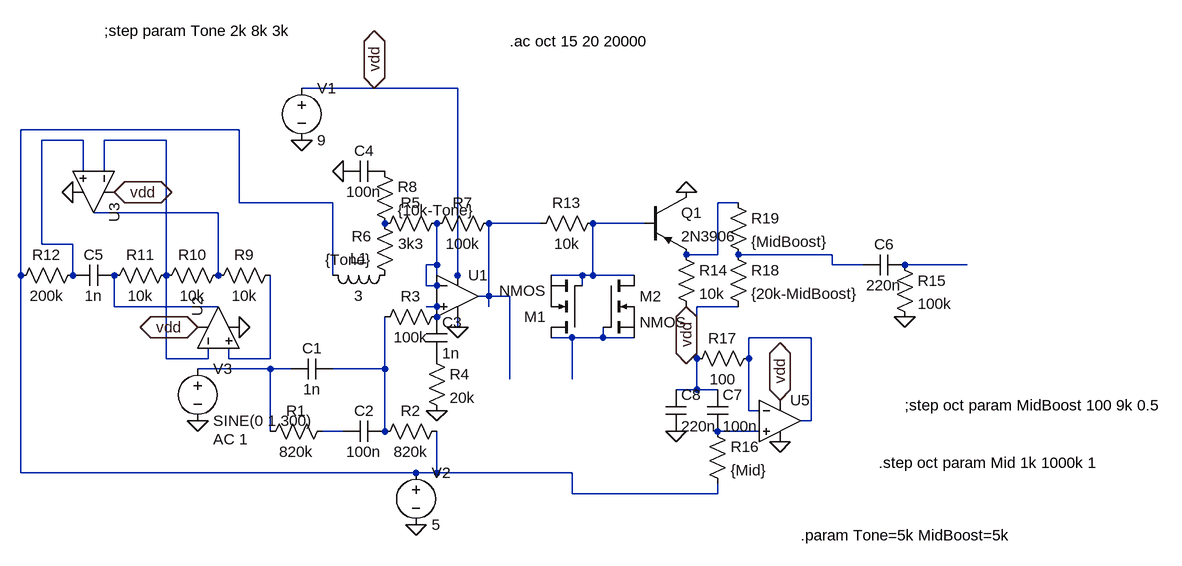
[diagram p0: schematic blue distortion.asc]
blue distortion.asc, the LTspice schematic file:
Version 4
SHEET 1 1308 680
WIRE 64 -96 -48 -96
WIRE 192 -96 64 -96
WIRE -144 -32 -480 -32
WIRE -384 -16 -448 -16
WIRE -256 -16 -352 -16
WIRE -384 32 -384 -16
WIRE -352 32 -352 -16
WIRE -144 80 -144 -32
WIRE 0 80 -144 80
WIRE 624 80 592 80
WIRE -176 96 -368 96
WIRE 320 112 240 112
WIRE 480 112 400 112
WIRE -448 144 -448 -16
WIRE -400 144 -448 144
WIRE 592 160 592 80
WIRE 592 160 544 160
WIRE 768 160 624 160
WIRE 160 176 160 112
WIRE 160 176 144 176
WIRE 768 176 768 160
WIRE 816 176 768 176
WIRE 976 176 880 176
WIRE -480 192 -480 -32
WIRE -400 192 -400 144
WIRE -256 192 -256 -16
WIRE -176 192 -176 96
WIRE 0 192 0 80
WIRE 192 192 192 -96
WIRE 384 192 336 192
WIRE 400 192 400 112
WIRE 400 192 384 192
WIRE 464 192 400 192
WIRE 144 208 144 176
WIRE 160 208 160 176
WIRE 160 208 144 208
WIRE 192 208 192 192
WIRE 384 208 384 192
WIRE 240 224 240 112
WIRE 240 224 224 224
WIRE 272 224 240 224
WIRE -336 240 -336 192
WIRE -176 240 -336 240
WIRE 160 240 144 240
WIRE 240 240 240 224
WIRE 624 240 560 240
WIRE 160 256 160 240
WIRE 192 272 192 256
WIRE 368 288 336 288
WIRE 416 288 416 272
WIRE 416 288 368 288
WIRE 464 288 416 288
WIRE 736 288 640 288
WIRE -256 320 -256 192
WIRE -192 320 -192 304
WIRE -192 320 -256 320
WIRE -160 320 -160 304
WIRE -96 320 -96 192
WIRE -96 320 -160 320
WIRE 560 320 560 240
WIRE 640 320 640 288
WIRE -96 336 -208 336
WIRE -64 336 -96 336
WIRE 80 336 80 256
WIRE 80 336 0 336
WIRE 272 352 272 224
WIRE 368 352 368 288
WIRE 560 368 560 320
WIRE 560 368 528 368
WIRE 592 368 560 368
WIRE 640 400 640 320
WIRE 656 400 640 400
WIRE 736 416 736 288
WIRE 736 416 720 416
WIRE -96 432 -96 336
WIRE 16 432 -16 432
WIRE 80 432 80 336
WIRE 656 432 592 432
WIRE -480 496 -480 192
WIRE 128 496 -480 496
WIRE 160 496 160 432
WIRE 160 496 128 496
WIRE 368 496 160 496
WIRE 368 528 368 496
WIRE 592 528 592 512
WIRE 592 528 368 528
FLAG -48 -16 0
FLAG 192 272 0
FLAG 128 576 0
FLAG 160 400 0
FLAG -208 416 0
FLAG 16 32 0
FLAG -400 64 0
FLAG 64 -96 vdd
IOPIN 64 -96 BiDir
FLAG -208 272 vdd
IOPIN -208 272 BiDir
FLAG -336 64 vdd
IOPIN -336 64 BiDir
FLAG -144 272 0
FLAG 544 240 vdd
IOPIN 544 240 BiDir
FLAG 544 64 0
FLAG 880 256 0
FLAG 688 448 0
FLAG 688 384 vdd
IOPIN 688 384 BiDir
FLAG 528 432 0
SYMBOL voltage -48 -112 R0
WINDOW 123 0 0 Left 0
WINDOW 39 0 0 Left 0
SYMATTR InstName V1
SYMATTR Value 9
SYMBOL voltage 128 480 R0
WINDOW 123 0 0 Left 0
WINDOW 39 0 0 Left 0
SYMATTR InstName V2
SYMATTR Value 5
SYMBOL cap 0 320 R90
WINDOW 0 0 32 VBottom 2
WINDOW 3 32 32 VTop 2
SYMATTR InstName C1
SYMATTR Value 1n
SYMBOL cap 80 416 R90
WINDOW 0 0 32 VBottom 2
WINDOW 3 32 32 VTop 2
SYMATTR InstName C2
SYMATTR Value 100n
SYMBOL res 176 416 R90
WINDOW 0 0 56 VBottom 2
WINDOW 3 32 56 VTop 2
SYMATTR InstName R2
SYMATTR Value 820k
SYMBOL res 176 240 R90
WINDOW 0 0 56 VBottom 2
WINDOW 3 32 56 VTop 2
SYMATTR InstName R3
SYMATTR Value 100k
SYMBOL cap 144 256 R0
SYMATTR InstName C3
SYMATTR Value 1n
SYMBOL res 144 304 R0
SYMATTR InstName R4
SYMATTR Value 20k
SYMBOL voltage -208 320 R0
WINDOW 123 24 124 Left 2
WINDOW 39 0 0 Left 0
SYMATTR InstName V3
SYMATTR Value SINE(0 1 300)
SYMATTR Value2 AC 1
SYMBOL res 176 96 R90
WINDOW 0 0 56 VBottom 2
WINDOW 3 32 56 VTop 2
SYMATTR InstName R5
SYMATTR Value 3k3
SYMBOL res 96 208 R180
WINDOW 0 36 76 Left 2
WINDOW 3 36 40 Left 2
SYMATTR InstName R6
SYMATTR Value {Tone}
SYMBOL res 256 96 R90
WINDOW 0 0 56 VBottom 2
WINDOW 3 32 56 VTop 2
SYMATTR InstName R7
SYMATTR Value 100k
SYMBOL res 64 16 R0
SYMATTR InstName R8
SYMATTR Value {10k-Tone}
SYMBOL cap 80 16 R90
WINDOW 0 0 32 VBottom 2
WINDOW 3 32 32 VTop 2
SYMATTR InstName C4
SYMATTR Value 100n
SYMBOL res -80 176 R90
WINDOW 0 0 56 VBottom 2
WINDOW 3 32 56 VTop 2
SYMATTR InstName R9
SYMATTR Value 10k
SYMBOL res -160 176 R90
WINDOW 0 0 56 VBottom 2
WINDOW 3 32 56 VTop 2
SYMATTR InstName R10
SYMATTR Value 10k
SYMBOL res -240 176 R90
WINDOW 0 0 56 VBottom 2
WINDOW 3 32 56 VTop 2
SYMATTR InstName R11
SYMATTR Value 10k
SYMBOL cap -336 176 R90
WINDOW 0 0 32 VBottom 2
WINDOW 3 32 32 VTop 2
SYMATTR InstName C5
SYMATTR Value 1n
SYMBOL res -384 176 R90
WINDOW 0 0 56 VBottom 2
WINDOW 3 32 56 VTop 2
SYMATTR InstName R12
SYMATTR Value 200k
SYMBOL res 0 416 R90
WINDOW 0 0 56 VBottom 2
WINDOW 3 32 56 VTop 2
SYMATTR InstName R1
SYMATTR Value 820k
SYMBOL pnp 480 64 R0
SYMATTR InstName Q1
SYMATTR Value 2N3906
SYMBOL res 416 96 R90
WINDOW 0 0 56 VBottom 2
WINDOW 3 32 56 VTop 2
SYMATTR InstName R13
SYMATTR Value 10k
SYMBOL nmos 384 288 R180
SYMATTR InstName M1
SYMBOL nmos 416 192 R0
SYMATTR InstName M2
SYMBOL res 528 144 R0
SYMATTR InstName R14
SYMATTR Value 10k
SYMBOL cap 880 160 R90
WINDOW 0 0 32 VBottom 2
WINDOW 3 32 32 VTop 2
SYMATTR InstName C6
SYMATTR Value 220n
SYMBOL res 864 160 R0
SYMATTR InstName R15
SYMATTR Value 100k
SYMBOL ind 96 176 R90
WINDOW 0 5 56 VBottom 2
WINDOW 3 32 56 VTop 2
SYMATTR InstName L1
SYMATTR Value 3
SYMBOL cap 576 368 R0
SYMATTR InstName C7
SYMATTR Value 100n
SYMBOL res 576 416 R0
SYMATTR InstName R16
SYMATTR Value {Mid}
SYMBOL cap 512 368 R0
SYMATTR InstName C8
SYMATTR Value 220n
SYMBOL res 656 304 R90
WINDOW 0 0 56 VBottom 2
WINDOW 3 32 56 VTop 2
SYMATTR InstName R17
SYMATTR Value 100
SYMBOL res 608 144 R0
SYMATTR InstName R18
SYMATTR Value {20k-MidBoost}
SYMBOL Opamps\\UniversalOpamp2 688 416 R0
SYMATTR InstName U5
SYMBOL res 608 64 R0
SYMATTR InstName R19
SYMATTR Value {MidBoost}
SYMBOL Opamps\\UniversalOpamp2 192 224 R0
SYMATTR InstName U1
SYMBOL Opamps\\UniversalOpamp2 -176 272 R270
SYMATTR InstName U2
SYMBOL Opamps\\UniversalOpamp2 -368 64 R90
SYMATTR InstName U3
TEXT -352 -184 Left 2 !;step param Tone 2k 8k 3k
TEXT 272 -168 Left 2 !.ac oct 15 20 20000
TEXT 840 480 Left 2 !.step oct param Mid 1k 1000k 1
TEXT 880 392 Left 2 !;step oct param MidBoost 100 9k 0.5
TEXT 720 592 Left 2 !.param Tone=5k MidBoost=5k

The netlist it stands for:
* blue distortion.asc
V1 vdd 0 9
V2 N001 0 5
C1 N018 N017 1n
C2 N018 N019 100n
R2 N001 N018 820k
R3 N012 N018 100k
C3 N012 P001 1n
R4 P001 0 20k
V3 N017 0 SINE(0 1 300) AC 1
R5 N009 P002 3k3
R6 P003 P002 {Tone}
R7 N006 N009 100k
R8 P004 P002 {10k-Tone}
C4 P004 0 100n
R9 N016 N005 10k
R10 N005 N003 10k
R11 N003 N011 10k
C5 N011 N002 1n
R12 N002 N001 200k
R1 N019 N017 820k
Q1 0 N007 N004 0 2N3906
R13 N007 N006 10k
M1 N014 N007 N007 N007 NMOS
M2 N007 N014 N014 N014 NMOS
R14 N004 vdd 10k
C6 N010 N008 220n
R15 N010 0 100k
L1 P003 N001 3
C7 N013 N020 100n
R16 N020 N001 {Mid}
C8 N013 0 220n
R17 N015 N013 100
R18 N008 N013 {20k-MidBoost}
XU5 N020 N015 vdd 0 N015 level.2 Avol=1Meg GBW=10Meg Slew=10Meg ilimit=25m rail=0 Vos=0 phimargin=45 en=0 enk=0 in=0 ink=0 Rin=500Meg  ; pins IN+ IN- V+ V- OUT
R19 N004 N008 {MidBoost}
XU1 N012 N009 vdd 0 N006 level.2 Avol=1Meg GBW=10Meg Slew=10Meg ilimit=25m rail=0 Vos=0 phimargin=45 en=0 enk=0 in=0 ink=0 Rin=500Meg  ; pins IN+ IN- V+ V- OUT
XU2 N016 N003 vdd 0 N011 level.2 Avol=1Meg GBW=10Meg Slew=10Meg ilimit=25m rail=0 Vos=0 phimargin=45 en=0 enk=0 in=0 ink=0 Rin=500Meg  ; pins IN+ IN- V+ V- OUT
XU3 N002 N003 vdd 0 N005 level.2 Avol=1Meg GBW=10Meg Slew=10Meg ilimit=25m rail=0 Vos=0 phimargin=45 en=0 enk=0 in=0 ink=0 Rin=500Meg  ; pins IN+ IN- V+ V- OUT
.model NPN NPN
.model PNP PNP
.lib standard.bjt
.model NMOS NMOS
.model PMOS PMOS
.lib standard.mos
;step param Tone 2k 8k 3k
.ac oct 15 20 20000
.step oct param Mid 1k 1000k 1
;step oct param MidBoost 100 9k 0.5
.param Tone=5k MidBoost=5k
.lib UniversalOpamps2.sub
.backanno
.end